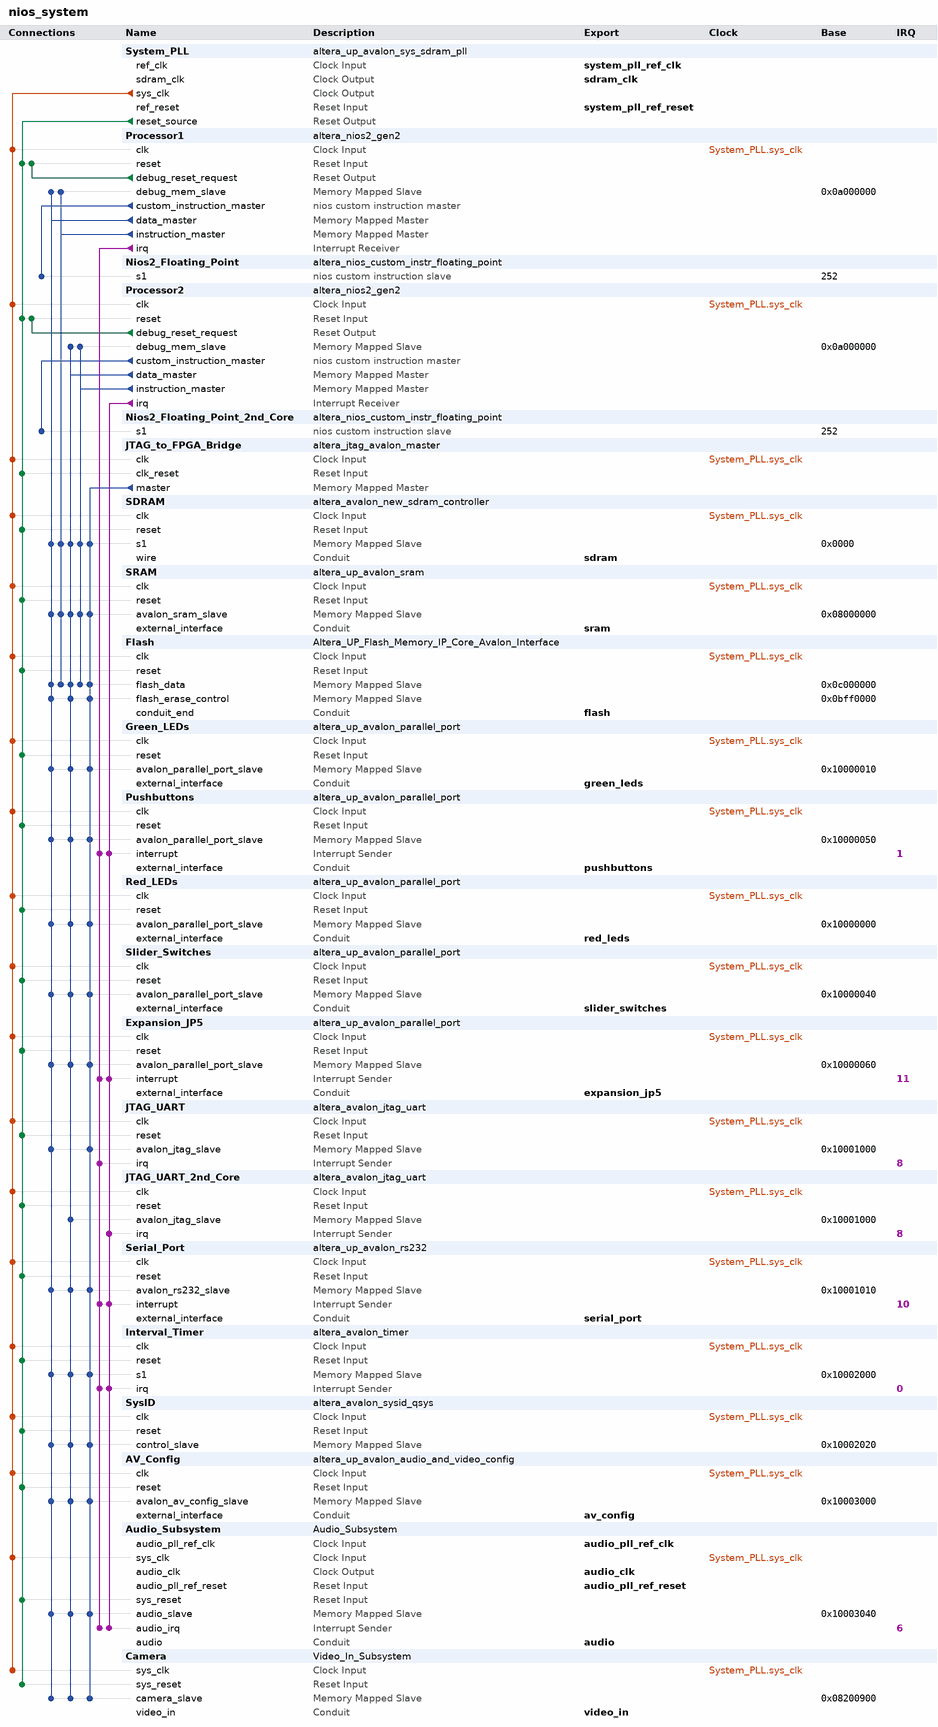
[diagram p0: system contents]
# Platform Designer (Qsys) system nios_system, Cyclone IV E EP4CE115F29C7
# Parameters at their usual value, and those the tool derives, are not listed.
package require -exact qsys 16.1
create_system nios_system
set_project_property DEVICE_FAMILY {Cyclone IV E}
set_project_property DEVICE EP4CE115F29C7

add_instance System_PLL altera_up_avalon_sys_sdram_pll 16.1
set_instance_parameter_value System_PLL CV_boards DE1-SoC
set_instance_parameter_value System_PLL gui_outclk 50.0
set_instance_parameter_value System_PLL gui_refclk 50.0

add_instance Processor1 altera_nios2_gen2 16.1
set_instance_parameter_value Processor1 dcache_size 0
set_instance_parameter_value Processor1 debug_datatrigger 2
set_instance_parameter_value Processor1 debug_hwbreakpoint 2
set_instance_parameter_value Processor1 debug_traceType instruction_trace
set_instance_parameter_value Processor1 dividerType srt2
set_instance_parameter_value Processor1 exceptionSlave SDRAM.s1
set_instance_parameter_value Processor1 icache_size 4096
set_instance_parameter_value Processor1 impl Tiny
set_instance_parameter_value Processor1 mul_64_impl 1
set_instance_parameter_value Processor1 mul_shift_choice 1
set_instance_parameter_value Processor1 resetSlave SDRAM.s1
set_instance_parameter_value Processor1 resetrequest_enabled false

add_instance Nios2_Floating_Point altera_nios_custom_instr_floating_point 16.1

add_instance Processor2 altera_nios2_gen2 16.1
set_instance_parameter_value Processor2 cpuID 1
set_instance_parameter_value Processor2 dcache_size 0
set_instance_parameter_value Processor2 debug_datatrigger 2
set_instance_parameter_value Processor2 debug_hwbreakpoint 2
set_instance_parameter_value Processor2 debug_traceType instruction_trace
set_instance_parameter_value Processor2 dividerType srt2
set_instance_parameter_value Processor2 exceptionOffset 67108896
set_instance_parameter_value Processor2 exceptionSlave SDRAM.s1
set_instance_parameter_value Processor2 icache_size 4096
set_instance_parameter_value Processor2 impl Tiny
set_instance_parameter_value Processor2 mul_64_impl 1
set_instance_parameter_value Processor2 mul_shift_choice 1
set_instance_parameter_value Processor2 resetOffset 67108864
set_instance_parameter_value Processor2 resetSlave SDRAM.s1
set_instance_parameter_value Processor2 resetrequest_enabled false

add_instance Nios2_Floating_Point_2nd_Core altera_nios_custom_instr_floating_point 16.1

add_instance JTAG_to_FPGA_Bridge altera_jtag_avalon_master 16.1

add_instance SDRAM altera_avalon_new_sdram_controller 16.1
set_instance_parameter_value SDRAM TAC 5.5
set_instance_parameter_value SDRAM TRCD 20.0
set_instance_parameter_value SDRAM TRP 20.0
set_instance_parameter_value SDRAM casLatency 3
set_instance_parameter_value SDRAM columnWidth 10
set_instance_parameter_value SDRAM dataWidth 32
set_instance_parameter_value SDRAM generateSimulationModel true
set_instance_parameter_value SDRAM model single_Micron_MT48LC4M32B2_7_chip
set_instance_parameter_value SDRAM numberOfBanks 4
set_instance_parameter_value SDRAM numberOfChipSelects 1
set_instance_parameter_value SDRAM powerUpDelay 100.0
set_instance_parameter_value SDRAM refreshPeriod 15.625
set_instance_parameter_value SDRAM rowWidth 13

add_instance SRAM altera_up_avalon_sram 16.1
set_instance_parameter_value SRAM board DE2-115
set_instance_parameter_value SRAM pixel_buffer true

add_instance Flash Altera_UP_Flash_Memory_IP_Core_Avalon_Interface 16.1
set_instance_parameter_value Flash FLASH_MEMORY_ADDRESS_WIDTH 23

add_instance Green_LEDs altera_up_avalon_parallel_port 16.1
set_instance_parameter_value Green_LEDs board DE2-115
set_instance_parameter_value Green_LEDs capture false
set_instance_parameter_value Green_LEDs edge Rising
set_instance_parameter_value Green_LEDs irq false
set_instance_parameter_value Green_LEDs preset LEDs

add_instance Pushbuttons altera_up_avalon_parallel_port 16.1
set_instance_parameter_value Pushbuttons board DE2-115
set_instance_parameter_value Pushbuttons capture true
set_instance_parameter_value Pushbuttons edge Falling
set_instance_parameter_value Pushbuttons irq true
set_instance_parameter_value Pushbuttons preset Pushbuttons

add_instance Red_LEDs altera_up_avalon_parallel_port 16.1
set_instance_parameter_value Red_LEDs board DE2-115
set_instance_parameter_value Red_LEDs capture false
set_instance_parameter_value Red_LEDs edge Rising
set_instance_parameter_value Red_LEDs irq false
set_instance_parameter_value Red_LEDs leds Red
set_instance_parameter_value Red_LEDs preset LEDs

add_instance Slider_Switches altera_up_avalon_parallel_port 16.1
set_instance_parameter_value Slider_Switches board DE2-115
set_instance_parameter_value Slider_Switches capture false
set_instance_parameter_value Slider_Switches edge Rising
set_instance_parameter_value Slider_Switches irq false
set_instance_parameter_value Slider_Switches preset {Slider Switches}

add_instance Expansion_JP5 altera_up_avalon_parallel_port 16.1
set_instance_parameter_value Expansion_JP5 board DE2-115
set_instance_parameter_value Expansion_JP5 capture true
set_instance_parameter_value Expansion_JP5 edge Falling
set_instance_parameter_value Expansion_JP5 irq true
set_instance_parameter_value Expansion_JP5 preset {Expansion Header}

add_instance JTAG_UART altera_avalon_jtag_uart 16.1
set_instance_parameter_value JTAG_UART simInteractiveOptions NO_INTERACTIVE_WINDOWS

add_instance JTAG_UART_2nd_Core altera_avalon_jtag_uart 16.1
set_instance_parameter_value JTAG_UART_2nd_Core simInteractiveOptions NO_INTERACTIVE_WINDOWS

add_instance Serial_Port altera_up_avalon_rs232 16.1
set_instance_parameter_value Serial_Port baud 115200
set_instance_parameter_value Serial_Port parity Odd

add_instance Interval_Timer altera_avalon_timer 16.1
set_instance_parameter_value Interval_Timer period 125.0
set_instance_parameter_value Interval_Timer periodUnits MSEC

add_instance SysID altera_avalon_sysid_qsys 16.1
set_instance_parameter_value SysID id 0

add_instance AV_Config altera_up_avalon_audio_and_video_config 16.1
set_instance_parameter_value AV_Config audio_in {Microphone to ADC}
set_instance_parameter_value AV_Config bit_length 32
set_instance_parameter_value AV_Config board DE2-115
set_instance_parameter_value AV_Config line_in_bypass true
set_instance_parameter_value AV_Config sampling_rate {48 kHz}

add_instance Audio_Subsystem Audio_Subsystem 1.0

add_instance Camera Video_In_Subsystem 1.0

# connections
add_connection System_PLL.sys_clk Audio_Subsystem.sys_clk clock
add_connection System_PLL.sys_clk AV_Config.clk clock
add_connection System_PLL.sys_clk Camera.sys_clk clock
add_connection System_PLL.sys_clk Expansion_JP5.clk clock
add_connection System_PLL.sys_clk Flash.clk clock
add_connection System_PLL.sys_clk Green_LEDs.clk clock
add_connection System_PLL.sys_clk Interval_Timer.clk clock
add_connection System_PLL.sys_clk JTAG_to_FPGA_Bridge.clk clock
add_connection System_PLL.sys_clk JTAG_UART.clk clock
add_connection System_PLL.sys_clk JTAG_UART_2nd_Core.clk clock
add_connection System_PLL.sys_clk Processor1.clk clock
add_connection System_PLL.sys_clk Processor2.clk clock
add_connection System_PLL.sys_clk Pushbuttons.clk clock
add_connection System_PLL.sys_clk Red_LEDs.clk clock
add_connection System_PLL.sys_clk SDRAM.clk clock
add_connection System_PLL.sys_clk Serial_Port.clk clock
add_connection System_PLL.sys_clk Slider_Switches.clk clock
add_connection System_PLL.sys_clk SRAM.clk clock
add_connection System_PLL.sys_clk SysID.clk clock
add_connection Processor1.debug_reset_request Processor1.reset reset
add_connection Processor2.debug_reset_request Processor2.reset reset
add_connection System_PLL.reset_source Audio_Subsystem.sys_reset reset
add_connection System_PLL.reset_source AV_Config.reset reset
add_connection System_PLL.reset_source Camera.sys_reset reset
add_connection System_PLL.reset_source Expansion_JP5.reset reset
add_connection System_PLL.reset_source Flash.reset reset
add_connection System_PLL.reset_source Green_LEDs.reset reset
add_connection System_PLL.reset_source Interval_Timer.reset reset
add_connection System_PLL.reset_source JTAG_to_FPGA_Bridge.clk_reset reset
add_connection System_PLL.reset_source JTAG_UART.reset reset
add_connection System_PLL.reset_source JTAG_UART_2nd_Core.reset reset
add_connection System_PLL.reset_source Processor1.reset reset
add_connection System_PLL.reset_source Processor2.reset reset
add_connection System_PLL.reset_source Pushbuttons.reset reset
add_connection System_PLL.reset_source Red_LEDs.reset reset
add_connection System_PLL.reset_source SDRAM.reset reset
add_connection System_PLL.reset_source Serial_Port.reset reset
add_connection System_PLL.reset_source Slider_Switches.reset reset
add_connection System_PLL.reset_source SRAM.reset reset
add_connection System_PLL.reset_source SysID.reset reset
add_connection JTAG_to_FPGA_Bridge.master Audio_Subsystem.audio_slave avalon
set_connection_parameter_value JTAG_to_FPGA_Bridge.master/Audio_Subsystem.audio_slave baseAddress 0x10003040
add_connection JTAG_to_FPGA_Bridge.master AV_Config.avalon_av_config_slave avalon
set_connection_parameter_value JTAG_to_FPGA_Bridge.master/AV_Config.avalon_av_config_slave baseAddress 0x10003000
add_connection JTAG_to_FPGA_Bridge.master Camera.camera_slave avalon
set_connection_parameter_value JTAG_to_FPGA_Bridge.master/Camera.camera_slave baseAddress 0x08200900
add_connection JTAG_to_FPGA_Bridge.master Expansion_JP5.avalon_parallel_port_slave avalon
set_connection_parameter_value JTAG_to_FPGA_Bridge.master/Expansion_JP5.avalon_parallel_port_slave baseAddress 0x10000060
add_connection JTAG_to_FPGA_Bridge.master Flash.flash_data avalon
set_connection_parameter_value JTAG_to_FPGA_Bridge.master/Flash.flash_data baseAddress 0x0c000000
add_connection JTAG_to_FPGA_Bridge.master Flash.flash_erase_control avalon
set_connection_parameter_value JTAG_to_FPGA_Bridge.master/Flash.flash_erase_control baseAddress 0x0bff0000
add_connection JTAG_to_FPGA_Bridge.master Green_LEDs.avalon_parallel_port_slave avalon
set_connection_parameter_value JTAG_to_FPGA_Bridge.master/Green_LEDs.avalon_parallel_port_slave baseAddress 0x10000010
add_connection JTAG_to_FPGA_Bridge.master Interval_Timer.s1 avalon
set_connection_parameter_value JTAG_to_FPGA_Bridge.master/Interval_Timer.s1 baseAddress 0x10002000
add_connection JTAG_to_FPGA_Bridge.master JTAG_UART.avalon_jtag_slave avalon
set_connection_parameter_value JTAG_to_FPGA_Bridge.master/JTAG_UART.avalon_jtag_slave baseAddress 0x10001000
add_connection JTAG_to_FPGA_Bridge.master Pushbuttons.avalon_parallel_port_slave avalon
set_connection_parameter_value JTAG_to_FPGA_Bridge.master/Pushbuttons.avalon_parallel_port_slave baseAddress 0x10000050
add_connection JTAG_to_FPGA_Bridge.master Red_LEDs.avalon_parallel_port_slave avalon
set_connection_parameter_value JTAG_to_FPGA_Bridge.master/Red_LEDs.avalon_parallel_port_slave baseAddress 0x10000000
add_connection JTAG_to_FPGA_Bridge.master SDRAM.s1 avalon
set_connection_parameter_value JTAG_to_FPGA_Bridge.master/SDRAM.s1 baseAddress 0x0000
add_connection JTAG_to_FPGA_Bridge.master Serial_Port.avalon_rs232_slave avalon
set_connection_parameter_value JTAG_to_FPGA_Bridge.master/Serial_Port.avalon_rs232_slave baseAddress 0x10001010
add_connection JTAG_to_FPGA_Bridge.master Slider_Switches.avalon_parallel_port_slave avalon
set_connection_parameter_value JTAG_to_FPGA_Bridge.master/Slider_Switches.avalon_parallel_port_slave baseAddress 0x10000040
add_connection JTAG_to_FPGA_Bridge.master SRAM.avalon_sram_slave avalon
set_connection_parameter_value JTAG_to_FPGA_Bridge.master/SRAM.avalon_sram_slave baseAddress 0x08000000
add_connection JTAG_to_FPGA_Bridge.master SysID.control_slave avalon
set_connection_parameter_value JTAG_to_FPGA_Bridge.master/SysID.control_slave baseAddress 0x10002020
add_connection Processor1.data_master Audio_Subsystem.audio_slave avalon
set_connection_parameter_value Processor1.data_master/Audio_Subsystem.audio_slave baseAddress 0x10003040
add_connection Processor1.data_master AV_Config.avalon_av_config_slave avalon
set_connection_parameter_value Processor1.data_master/AV_Config.avalon_av_config_slave baseAddress 0x10003000
add_connection Processor1.data_master Camera.camera_slave avalon
set_connection_parameter_value Processor1.data_master/Camera.camera_slave baseAddress 0x08200900
add_connection Processor1.data_master Expansion_JP5.avalon_parallel_port_slave avalon
set_connection_parameter_value Processor1.data_master/Expansion_JP5.avalon_parallel_port_slave baseAddress 0x10000060
add_connection Processor1.data_master Flash.flash_data avalon
set_connection_parameter_value Processor1.data_master/Flash.flash_data baseAddress 0x0c000000
add_connection Processor1.data_master Flash.flash_erase_control avalon
set_connection_parameter_value Processor1.data_master/Flash.flash_erase_control baseAddress 0x0bff0000
add_connection Processor1.data_master Green_LEDs.avalon_parallel_port_slave avalon
set_connection_parameter_value Processor1.data_master/Green_LEDs.avalon_parallel_port_slave baseAddress 0x10000010
add_connection Processor1.data_master Interval_Timer.s1 avalon
set_connection_parameter_value Processor1.data_master/Interval_Timer.s1 baseAddress 0x10002000
add_connection Processor1.data_master JTAG_UART.avalon_jtag_slave avalon
set_connection_parameter_value Processor1.data_master/JTAG_UART.avalon_jtag_slave baseAddress 0x10001000
add_connection Processor1.data_master Processor1.debug_mem_slave avalon
set_connection_parameter_value Processor1.data_master/Processor1.debug_mem_slave baseAddress 0x0a000000
add_connection Processor1.data_master Pushbuttons.avalon_parallel_port_slave avalon
set_connection_parameter_value Processor1.data_master/Pushbuttons.avalon_parallel_port_slave baseAddress 0x10000050
add_connection Processor1.data_master Red_LEDs.avalon_parallel_port_slave avalon
set_connection_parameter_value Processor1.data_master/Red_LEDs.avalon_parallel_port_slave baseAddress 0x10000000
add_connection Processor1.data_master SDRAM.s1 avalon
set_connection_parameter_value Processor1.data_master/SDRAM.s1 baseAddress 0x0000
add_connection Processor1.data_master Serial_Port.avalon_rs232_slave avalon
set_connection_parameter_value Processor1.data_master/Serial_Port.avalon_rs232_slave baseAddress 0x10001010
add_connection Processor1.data_master Slider_Switches.avalon_parallel_port_slave avalon
set_connection_parameter_value Processor1.data_master/Slider_Switches.avalon_parallel_port_slave baseAddress 0x10000040
add_connection Processor1.data_master SRAM.avalon_sram_slave avalon
set_connection_parameter_value Processor1.data_master/SRAM.avalon_sram_slave baseAddress 0x08000000
add_connection Processor1.data_master SysID.control_slave avalon
set_connection_parameter_value Processor1.data_master/SysID.control_slave baseAddress 0x10002020
add_connection Processor1.instruction_master Flash.flash_data avalon
set_connection_parameter_value Processor1.instruction_master/Flash.flash_data baseAddress 0x0c000000
add_connection Processor1.instruction_master Processor1.debug_mem_slave avalon
set_connection_parameter_value Processor1.instruction_master/Processor1.debug_mem_slave baseAddress 0x0a000000
add_connection Processor1.instruction_master SDRAM.s1 avalon
set_connection_parameter_value Processor1.instruction_master/SDRAM.s1 baseAddress 0x0000
add_connection Processor1.instruction_master SRAM.avalon_sram_slave avalon
set_connection_parameter_value Processor1.instruction_master/SRAM.avalon_sram_slave baseAddress 0x08000000
add_connection Processor2.data_master Audio_Subsystem.audio_slave avalon
set_connection_parameter_value Processor2.data_master/Audio_Subsystem.audio_slave baseAddress 0x10003040
add_connection Processor2.data_master AV_Config.avalon_av_config_slave avalon
set_connection_parameter_value Processor2.data_master/AV_Config.avalon_av_config_slave baseAddress 0x10003000
add_connection Processor2.data_master Camera.camera_slave avalon
set_connection_parameter_value Processor2.data_master/Camera.camera_slave baseAddress 0x08200900
add_connection Processor2.data_master Expansion_JP5.avalon_parallel_port_slave avalon
set_connection_parameter_value Processor2.data_master/Expansion_JP5.avalon_parallel_port_slave baseAddress 0x10000060
add_connection Processor2.data_master Flash.flash_data avalon
set_connection_parameter_value Processor2.data_master/Flash.flash_data baseAddress 0x0c000000
add_connection Processor2.data_master Flash.flash_erase_control avalon
set_connection_parameter_value Processor2.data_master/Flash.flash_erase_control baseAddress 0x0bff0000
add_connection Processor2.data_master Green_LEDs.avalon_parallel_port_slave avalon
set_connection_parameter_value Processor2.data_master/Green_LEDs.avalon_parallel_port_slave baseAddress 0x10000010
add_connection Processor2.data_master Interval_Timer.s1 avalon
set_connection_parameter_value Processor2.data_master/Interval_Timer.s1 baseAddress 0x10002000
add_connection Processor2.data_master JTAG_UART_2nd_Core.avalon_jtag_slave avalon
set_connection_parameter_value Processor2.data_master/JTAG_UART_2nd_Core.avalon_jtag_slave baseAddress 0x10001000
add_connection Processor2.data_master Processor2.debug_mem_slave avalon
set_connection_parameter_value Processor2.data_master/Processor2.debug_mem_slave baseAddress 0x0a000000
add_connection Processor2.data_master Pushbuttons.avalon_parallel_port_slave avalon
set_connection_parameter_value Processor2.data_master/Pushbuttons.avalon_parallel_port_slave baseAddress 0x10000050
add_connection Processor2.data_master Red_LEDs.avalon_parallel_port_slave avalon
set_connection_parameter_value Processor2.data_master/Red_LEDs.avalon_parallel_port_slave baseAddress 0x10000000
add_connection Processor2.data_master SDRAM.s1 avalon
set_connection_parameter_value Processor2.data_master/SDRAM.s1 baseAddress 0x0000
add_connection Processor2.data_master Serial_Port.avalon_rs232_slave avalon
set_connection_parameter_value Processor2.data_master/Serial_Port.avalon_rs232_slave baseAddress 0x10001010
add_connection Processor2.data_master Slider_Switches.avalon_parallel_port_slave avalon
set_connection_parameter_value Processor2.data_master/Slider_Switches.avalon_parallel_port_slave baseAddress 0x10000040
add_connection Processor2.data_master SRAM.avalon_sram_slave avalon
set_connection_parameter_value Processor2.data_master/SRAM.avalon_sram_slave baseAddress 0x08000000
add_connection Processor2.data_master SysID.control_slave avalon
set_connection_parameter_value Processor2.data_master/SysID.control_slave baseAddress 0x10002020
add_connection Processor2.instruction_master Flash.flash_data avalon
set_connection_parameter_value Processor2.instruction_master/Flash.flash_data baseAddress 0x0c000000
add_connection Processor2.instruction_master Processor2.debug_mem_slave avalon
set_connection_parameter_value Processor2.instruction_master/Processor2.debug_mem_slave baseAddress 0x0a000000
add_connection Processor2.instruction_master SDRAM.s1 avalon
set_connection_parameter_value Processor2.instruction_master/SDRAM.s1 baseAddress 0x0000
add_connection Processor2.instruction_master SRAM.avalon_sram_slave avalon
set_connection_parameter_value Processor2.instruction_master/SRAM.avalon_sram_slave baseAddress 0x08000000
add_connection Processor1.irq Audio_Subsystem.audio_irq interrupt
set_connection_parameter_value Processor1.irq/Audio_Subsystem.audio_irq irqNumber 6
add_connection Processor1.irq Expansion_JP5.interrupt interrupt
set_connection_parameter_value Processor1.irq/Expansion_JP5.interrupt irqNumber 11
add_connection Processor1.irq Interval_Timer.irq interrupt
set_connection_parameter_value Processor1.irq/Interval_Timer.irq irqNumber 0
add_connection Processor1.irq JTAG_UART.irq interrupt
set_connection_parameter_value Processor1.irq/JTAG_UART.irq irqNumber 8
add_connection Processor1.irq Pushbuttons.interrupt interrupt
set_connection_parameter_value Processor1.irq/Pushbuttons.interrupt irqNumber 1
add_connection Processor1.irq Serial_Port.interrupt interrupt
set_connection_parameter_value Processor1.irq/Serial_Port.interrupt irqNumber 10
add_connection Processor2.irq Audio_Subsystem.audio_irq interrupt
set_connection_parameter_value Processor2.irq/Audio_Subsystem.audio_irq irqNumber 6
add_connection Processor2.irq Expansion_JP5.interrupt interrupt
set_connection_parameter_value Processor2.irq/Expansion_JP5.interrupt irqNumber 11
add_connection Processor2.irq Interval_Timer.irq interrupt
set_connection_parameter_value Processor2.irq/Interval_Timer.irq irqNumber 0
add_connection Processor2.irq JTAG_UART_2nd_Core.irq interrupt
set_connection_parameter_value Processor2.irq/JTAG_UART_2nd_Core.irq irqNumber 8
add_connection Processor2.irq Pushbuttons.interrupt interrupt
set_connection_parameter_value Processor2.irq/Pushbuttons.interrupt irqNumber 1
add_connection Processor2.irq Serial_Port.interrupt interrupt
set_connection_parameter_value Processor2.irq/Serial_Port.interrupt irqNumber 10
add_connection Processor1.custom_instruction_master Nios2_Floating_Point.s1 nios_custom_instruction
set_connection_parameter_value Processor1.custom_instruction_master/Nios2_Floating_Point.s1 CIName nios2_floating_point
set_connection_parameter_value Processor1.custom_instruction_master/Nios2_Floating_Point.s1 baseAddress 252
add_connection Processor2.custom_instruction_master Nios2_Floating_Point_2nd_Core.s1 nios_custom_instruction
set_connection_parameter_value Processor2.custom_instruction_master/Nios2_Floating_Point_2nd_Core.s1 CIName nios2_floating_point_2nd_core
set_connection_parameter_value Processor2.custom_instruction_master/Nios2_Floating_Point_2nd_Core.s1 baseAddress 252

# exported interfaces
add_interface audio conduit end
set_interface_property audio EXPORT_OF Audio_Subsystem.audio
add_interface audio_clk clock source
set_interface_property audio_clk EXPORT_OF Audio_Subsystem.audio_clk
add_interface audio_pll_ref_clk clock sink
set_interface_property audio_pll_ref_clk EXPORT_OF Audio_Subsystem.audio_pll_ref_clk
add_interface audio_pll_ref_reset reset sink
set_interface_property audio_pll_ref_reset EXPORT_OF Audio_Subsystem.audio_pll_ref_reset
add_interface av_config conduit end
set_interface_property av_config EXPORT_OF AV_Config.external_interface
add_interface expansion_jp5 conduit end
set_interface_property expansion_jp5 EXPORT_OF Expansion_JP5.external_interface
add_interface flash conduit end
set_interface_property flash EXPORT_OF Flash.conduit_end
add_interface green_leds conduit end
set_interface_property green_leds EXPORT_OF Green_LEDs.external_interface
add_interface pushbuttons conduit end
set_interface_property pushbuttons EXPORT_OF Pushbuttons.external_interface
add_interface red_leds conduit end
set_interface_property red_leds EXPORT_OF Red_LEDs.external_interface
add_interface sdram conduit end
set_interface_property sdram EXPORT_OF SDRAM.wire
add_interface sdram_clk clock source
set_interface_property sdram_clk EXPORT_OF System_PLL.sdram_clk
add_interface serial_port conduit end
set_interface_property serial_port EXPORT_OF Serial_Port.external_interface
add_interface slider_switches conduit end
set_interface_property slider_switches EXPORT_OF Slider_Switches.external_interface
add_interface sram conduit end
set_interface_property sram EXPORT_OF SRAM.external_interface
add_interface system_pll_ref_clk clock sink
set_interface_property system_pll_ref_clk EXPORT_OF System_PLL.ref_clk
add_interface system_pll_ref_reset reset sink
set_interface_property system_pll_ref_reset EXPORT_OF System_PLL.ref_reset
add_interface video_in conduit end
set_interface_property video_in EXPORT_OF Camera.video_in

set_interconnect_requirement {$system} qsys_mm.clockCrossingAdapter HANDSHAKE
set_interconnect_requirement {$system} qsys_mm.enableEccProtection FALSE
set_interconnect_requirement {$system} qsys_mm.insertDefaultSlave FALSE
set_interconnect_requirement {$system} qsys_mm.maxAdditionalLatency 1

save_system nios_system.qsys
